# EAGLE design howland_vccs_single_ended (EAGLE 6.4)
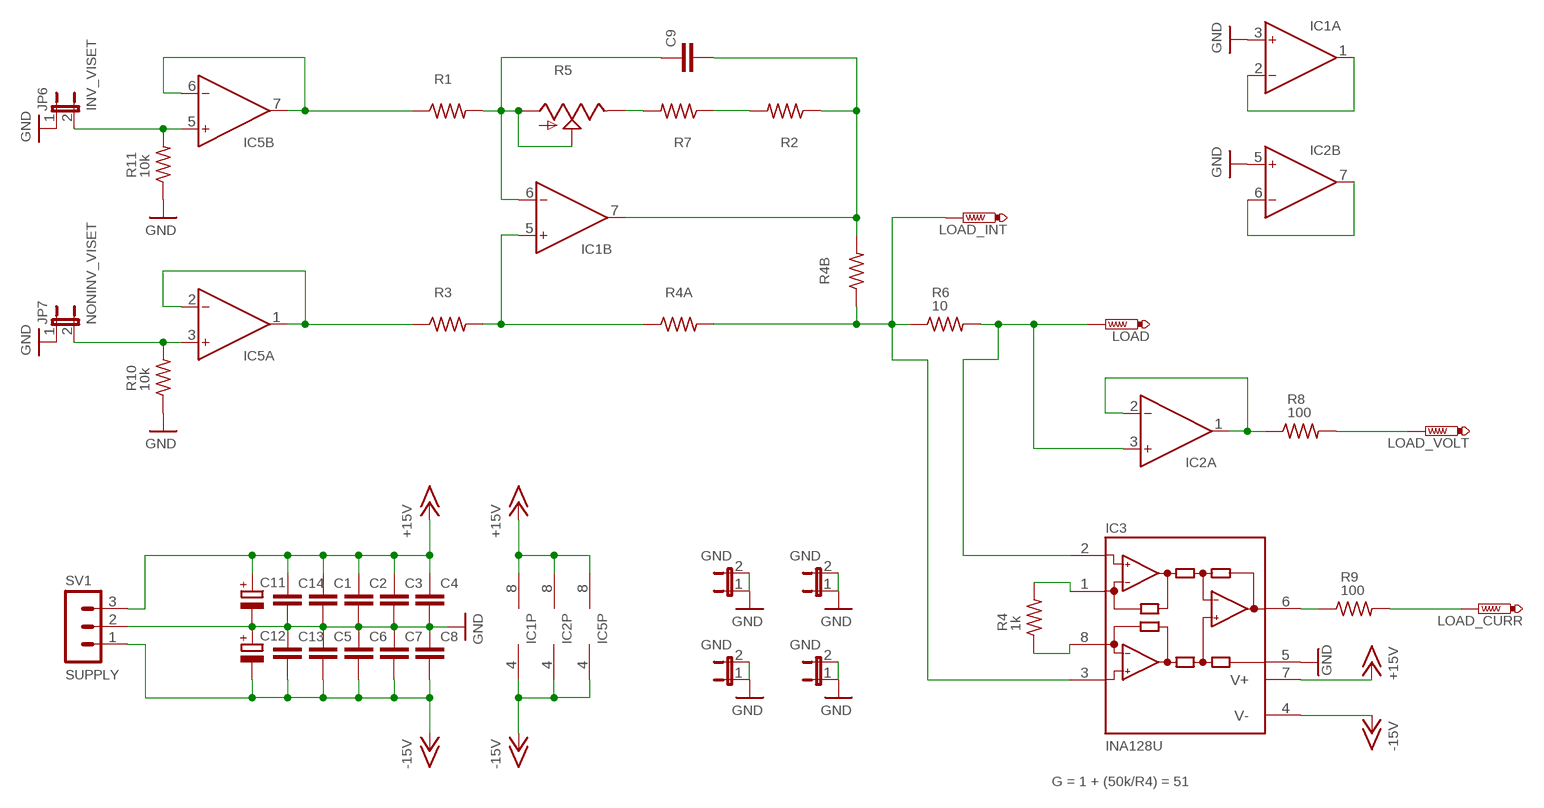
[diagram p0: schematic, sheet 1]

## Parts
C1  C-EUC1206  [C1206]
C2  C-EUC1206  [C1206]
C3  C-EUC1206  [C1206]
C4  C-EUC1206  [C1206]
C5  C-EUC1206  [C1206]
C6  C-EUC1206  [C1206]
C7  C-EUC1206  [C1206]
C8  C-EUC1206  [C1206]
C9  C-EUC1206  [C1206]
C11  CPOL-EUC/6032-28R  [C/6032-28R]
C12  CPOL-EUC/6032-28R  [C/6032-28R]
C13  C-EUC1206  [C1206]
C14  C-EUC1206  [C1206]
IC1  LM358  AD826R  [SO8]
IC2  LM358  AD826R  [SO8]
IC3  INA128U  [SO08]
IC5  OPA2192  AD826R  [SO8]
JP4  GND  JP1E  [JP1]
JP6  INV_VISET  JP1E  [JP1]
JP7  NONINV_VISET  JP1E  [JP1]
JP8  GND  JP1E  [JP1]
JP9  GND  JP1E  [JP1]
JP10  GND  JP1E  [JP1]
LOAD  PTR1PAD1-13  [P1-13]
LOAD_CURR  PTR1PAD1-13  [P1-13]
LOAD_INT  PTR1PAD1-13  [P1-13]
LOAD_VOLT  PTR1PAD1-13  [P1-13]
R1  12.25k/0.1%  R-US_R1206  [R1206]
R2  10k/.1%  R-US_R1206  [R1206]
R3  12.25k/0.1%  R-US_R1206  [R1206]
R4  1k  R-US_R1206  [R1206]
R4A  10k/.1%  R-US_R1206  [R1206]
R4B  250  R-US_R1206  [R1206]
R5  100  TRIM_US-3223J  [3223J]
R6  10  R-US_R1206  [R1206]
R7  200  R-US_R1206  [R1206]
R8  100  R-US_R1206  [R1206]
R9  100  R-US_R1206  [R1206]
R10  10k  R-US_R1206  [R1206]
R11  10k  R-US_R1206  [R1206]
SV1  SUPPLY  MA03-1  [MA03-1]

## Nets
+15V: C1.1 C2.1 C3.1 C4.1 C11.+ C14.1 IC1.8(P:V+) IC2.8(P:V+) IC3.7(V+) IC5.8(P:V+) SV1.3
-15V: C5.2 C6.2 C7.2 C8.2 C12.- C13.2 IC1.4(P:V-) IC2.4(P:V-) IC3.4(V-) IC5.4(P:V-) SV1.1
GND: C1.2 C2.2 C3.2 C4.2 C5.1 C6.1 C7.1 C8.1 C11.- C12.+ C13.1 C14.2 IC1.3(A:IN+) IC2.5(B:IN+) IC3.5(REF) JP4.1 JP4.2 JP6.1 JP7.1 JP8.1 JP8.2 JP9.1 JP9.2 JP10.1 JP10.2 R10.1 R11.1 SV1.2
N$1: IC2.1(A:OUT) IC2.2(A:IN-) R8.1
N$2: IC1.5(B:IN+) R3.2 R4A.1
N$3: C9.1 IC1.6(B:IN-) R1.2 R5.1(A) R5.2(S)
N$4: C9.2 IC1.7(B:OUT) R2.1 R4B.2
N$5: IC3.3(+IN) LOAD_INT.TP R4A.2 R4B.1 R6.1
N$6: R5.3(E) R7.2
N$7: IC3.1(RG) R4.2
N$8: IC3.8(RG) R4.1
N$9: IC3.6(OUT) R9.1
N$10: IC1.1(A:OUT) IC1.2(A:IN-)
N$11: R2.2 R7.1
N$12: IC5.1(A:OUT) IC5.2(A:IN-) R3.1
N$13: IC5.6(B:IN-) IC5.7(B:OUT) R1.1
N$14: IC5.3(A:IN+) JP7.2 R10.2
N$15: IC5.5(B:IN+) JP6.2 R11.2
N$16: LOAD_VOLT.TP R8.2
N$17: LOAD_CURR.TP R9.2
N$25: IC2.6(B:IN-) IC2.7(B:OUT)
N$26: IC2.3(A:IN+) IC3.2(-IN) LOAD.TP R6.2

## Notes on the sheet
- G = 1 + (50k/R4) = 51

## Library data of the parts
C1-C9 C13 C14 = rcl:C-EU: CAPACITOR, European symbol
C11 C12 = rcl:CPOL-EU: POLARIZED CAPACITOR, European symbol
IC1 IC2 IC5 = analog-devices:AD826: High-Speed, Low-Power Dual Operational Amplifier Source: http://www.analog.com/static/imported-files/data_sheets/AD826.pdf; MF: ALTERA CORPORATION; MPN: AD826AR; OC_FARNELL: 1651291; OC_NEWARK: 05F7688
IC3 = burr-brown:INA128: Instrumentation Amplifiers Precision, Low Power; MF: TEXAS INSTRUMENTS; MPN: INA128U; OC_FARNELL: 1212413; OC_NEWARK: 35C1729
JP4 JP6-JP10 = jumper:JP1E: JUMPER
LOAD LOAD_CURR LOAD_INT LOAD_VOLT = testpad:PTR1: TEST PIN
R1-R4 R4A R4B R6-R11 = rcl:R-US_: RESISTOR, American symbol
R5 = pot:TRIM_US-: POTENTIOMETER
SV1 = con-lstb:MA03-1: PIN HEADER; OC_FARNELL: unknown; OC_NEWARK: unknown

## Board
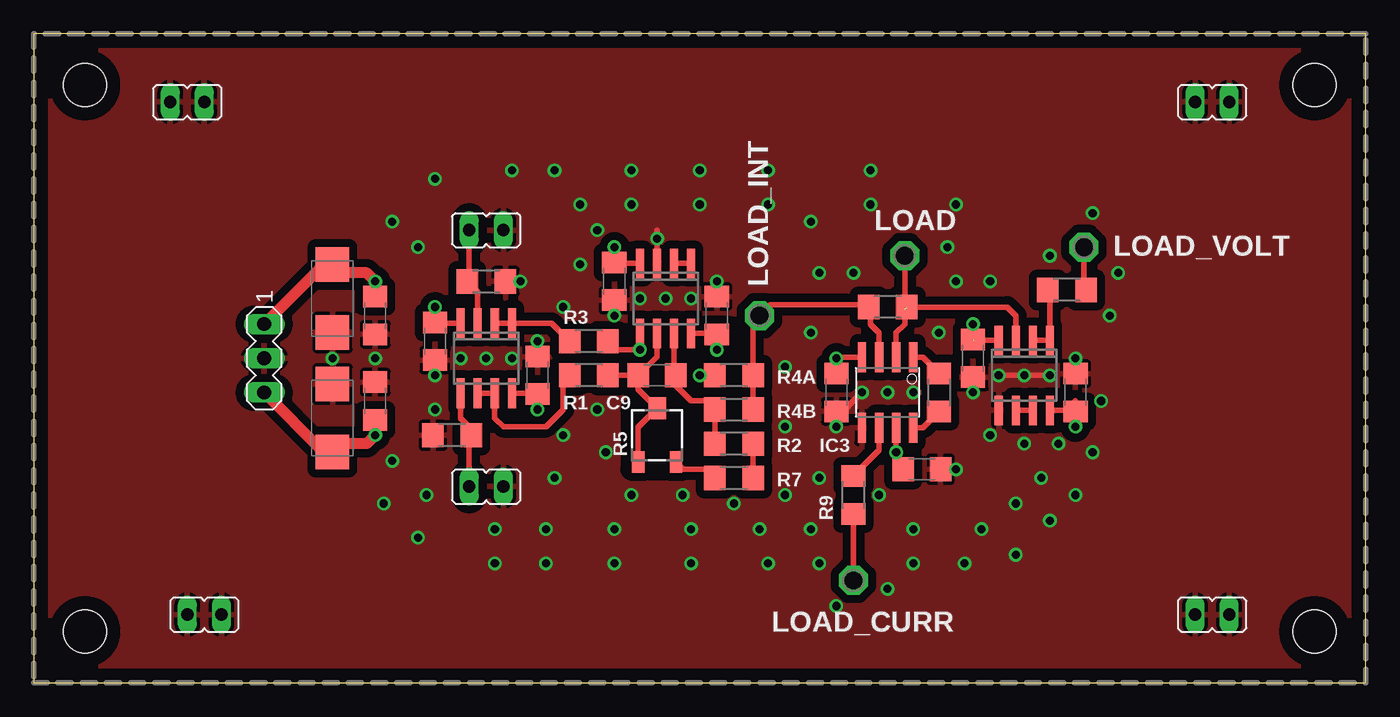
[diagram p1: board, top side]
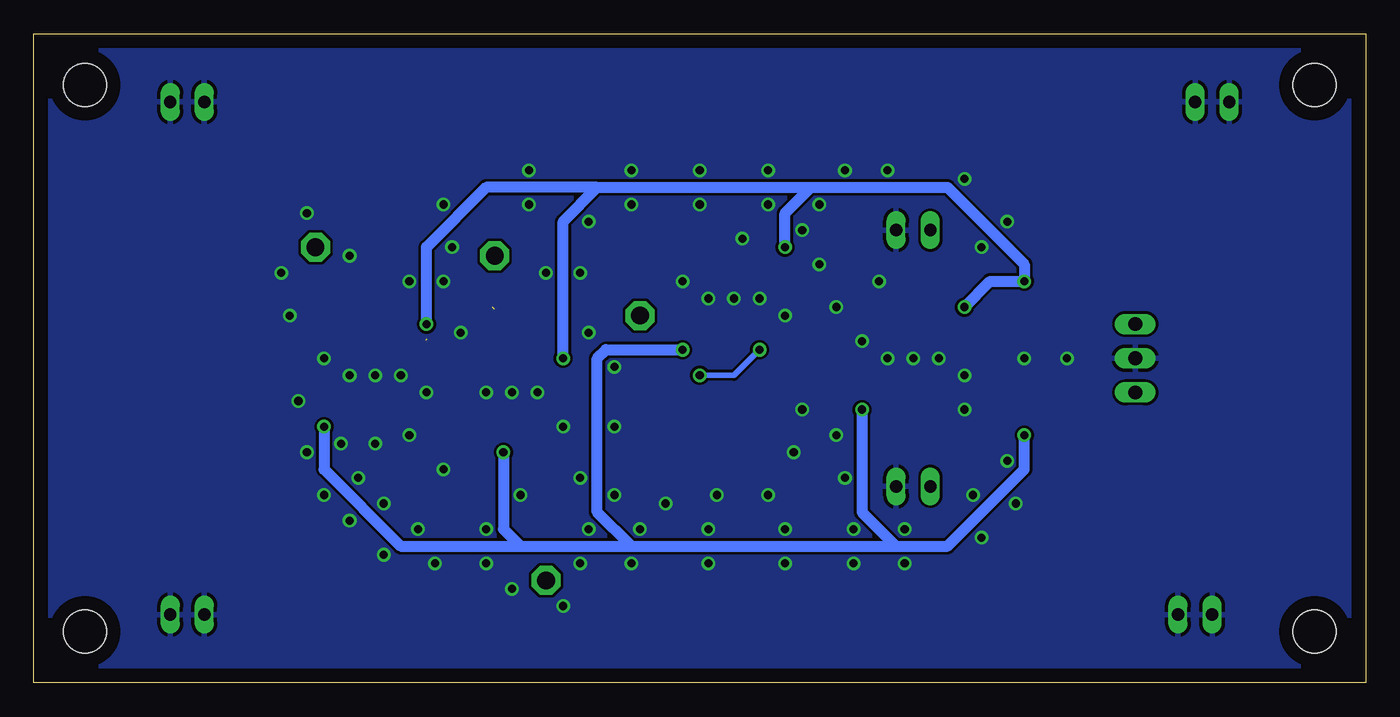
[diagram p2: board, bottom side, seen from below]

Size 99.06 x 48.26 mm. Coordinates in mm from the lower left corner, seen from the top.
Outline: 0,0 99.06,0 99.06,48.26 0,48.26 0,0
Copper layers (1*16): Top 0.035mm / dielectric 1.5mm / Bottom 0.035mm
Design rules "default *": minimum track width 10mil, minimum drill 24mil, track to track 8mil, track to pad 8mil, pad to pad 8mil, via to via 8mil, smd to smd 8mil, copper to edge 40mil, drill to drill 8mil, minimum pad ring 10mil, minimum via ring 8mil, stop-mask expansion 4mil, vias tented up to drill 0mil, thermal gap 10mil
Holes 3.2 mm at 3.81,44.45 95.25,44.45 3.81,3.81 95.25,3.81
tRestrict: 4 lines

### Footprints (pad centres in the part's own frame; a part is rotated, then mirrored left to right if it is on the bottom)
C1206 = smd 1.6 x 1.8: 1 -1.4,0; 2 1.4,0
C/6032-28R = smd 2.55 x 2.5: + 2.525,0; - -2.525,0
SO8 = smd 0.6 x 2.2: 1 -1.905,-2.6; 2 -0.635,-2.6; 3 0.635,-2.6; 4 1.905,-2.6; 5 1.905,2.6; 6 0.635,2.6; 7 -0.635,2.6; 8 -1.905,2.6
SO08 = smd 0.61 x 2.21: 1 -1.905,-2.616; 2 -0.635,-2.616; 3 0.635,-2.616; 4 1.905,-2.616; 5 1.905,2.616; 6 0.635,2.616; 7 -0.635,2.616; 8 -1.905,2.616
JP1 = drill 0.914 long: 1 0,-1.27; 2 0,1.27
P1-13 = drill 1.321 pad 2.159 octagon: TP 0,0
R1206 = smd 1.6 x 1.803: 1 -1.422,0; 2 1.422,0
3223J = smd 1.6 x 0.9: 1 -2,1.4; 3 -2,-1.4 | smd 1.6 x 1.3: 2 2,0
MA03-1 = drill 1.016 long: 1 -2.54,0; 2 0,0; 3 2.54,0

### Placement (x,y rotation side)
C1  50.8,27.3 90 top
C2  77.47,21.59 90 top
C3  66.04,15.87 0 top
C4  37.47,22.86 90 top
C5  43.18,29.84 90 top
C6  69.85,24.13 90 top
C7  59.69,21.59 90 top
C8  29.85,25.4 90 top
C9  46.36,22.86 0 top
C11  22.23,19.68 270 top
C12  22.23,28.57 270 top
C13  25.4,27.3 90 top
C14  25.4,20.95 90 top
IC1  46.99,28.57 180 top
IC2  73.66,22.86 180 top
IC3  63.5,21.59 180 top
IC5  33.66,24.13 180 top
JP4  11.43,43.18 90 top
JP6  33.66,14.6 90 top
JP7  33.66,33.66 90 top
JP8  87.63,43.18 90 top
JP9  12.7,5.08 90 top
JP10  87.63,5.08 90 top
LOAD  64.77,31.75 0 top
LOAD_CURR  60.96,7.62 0 top
LOAD_INT  53.98,27.3 0 top
LOAD_VOLT  78.11,32.38 0 top
R1  41.27,22.86 0 top
R2  52.07,17.78 0 top
R3  41.27,25.4 0 top
R4  67.31,21.59 90 top
R4A  52.07,22.86 0 top
R4B  52.07,20.32 180 top
R5  46.36,18.41 90 top
R6  63.5,27.94 0 top
R7  52.07,15.24 180 top
R8  76.84,29.21 0 top
R9  60.96,13.97 270 top
R10  33.66,29.84 180 top
R11  31.12,18.41 0 top
SV1  17.15,24.13 270 top

### Tracks (layer width: path | path; a pad name or v marks a point on that pad's centre or on a via)
+15V  (via drill 0.6, 0.6 pad 0.25)
  Top 0.406: IC3.7 v64.14,17.14 64.14,16.38 C3.1 64.64,16 | IC2.8 76.78,20.26 77.47,20.95 C2.1 v77.47,19.05 | v50.8,24.77 C1.1 50.73,25.97 IC1.8 | v37.47,20.32 C4.1 37.4,21.53 IC5.8
  Top 0.813: C14.1 v25.4,18.41 24.77,17.78 22.85,17.78 C11.+ 21.58,17.16 SV1.3
  Bottom 0.813: v64.14,17.14 64.14,11.43 62.87,10.16 | 54.61,10.16 57.15,12.7 57.15,24.13 56.52,24.77 v50.8,24.77 | v77.47,19.05 77.47,15.87 71.75,10.16 62.87,10.16 | 62.87,10.16 54.61,10.16 | 54.61,10.16 34.92,10.16 | 34.92,10.16 31.12,10.16 25.4,15.87 v25.4,18.41 | v37.47,20.32 37.47,12.7 34.92,10.16
-15V  (via drill 0.6, 0.6 pad 0.25)  (1 unrouted)
  Top 0.406: IC3.4 59.77,24.21 v59.69,24.13 C7.2 | v29.85,27.94 C8.2 29.92,26.73 IC5.4 | C6.2 v69.85,26.67 | IC2.4 69.91,25.46 | IC1.4 43.25,31.17 C5.2 v43.18,32.38
  Top 0.813: C13.2 v25.4,29.84 24.77,30.48 22.85,30.48 C12.- 21.58,31.1 SV1.1
  Bottom 0.813: v43.18,32.38 43.18,34.92 41.27,36.83 | v69.85,26.67 69.85,32.38 65.41,36.83 57.15,36.83 | v59.69,24.13 59.69,34.29 57.15,36.83 | 57.15,36.83 41.27,36.83 | 41.27,36.83 31.12,36.83 25.4,31.11 v25.4,29.84 27.94,29.84 v29.85,27.94
GND  (via drill 0.6 pad 0.25)
  Top 0.406: C2.2 v77.47,24.13 | C7.1 59.69,19.68 | v71.75,22.86 v75.56,22.86 | v61.59,21.59 59.69,19.68 | 59.69,19.68 v59.69,19.05 | IC1.3 46.36,33.66
  other vias: 57.79,26.04 41.91,33.66 44.45,35.56 42.55,17.14 44.45,13.97 48.26,13.97 78.74,17.14 46.36,33.02 58.42,30.48 29.85,22.86 37.47,25.4 68.58,15.87 60.96,30.48 57.79,34.29 55.88,13.97 58.42,15.24 41.91,20.32 69.85,21.59 25.4,24.13 22.23,24.13 29.85,20.32 28.58,32.38 36.2,29.84 39.37,27.94 43.18,27.3 39.37,18.41 33.66,24.13 31.75,24.13 35.56,24.13 55.88,23.49 40.64,31.11 63.5,21.59 65.41,21.59 73.66,22.86 71.12,18.41 73.66,17.78 76.2,17.78 79.38,20.95 80.64,30.48 80.01,27.3 75.56,31.75 68.58,29.84 67.31,26.04 71.12,29.84 38.1,11.43 43.18,8.89 38.73,38.1 29.85,37.47 48.9,8.89 55.88,19.05 54.61,8.89 77.47,13.97 57.79,11.43 58.42,8.89 65.41,11.43 35.56,38.1 49.53,38.1 49.53,35.56 54.61,38.1 62.23,35.56 68.58,35.56 62.23,38.1 67.94,32.38 78.74,34.92 26.67,34.29 40.64,35.56 50.8,29.84 44.45,38.1 54.61,35.56 43.18,11.43 34.29,11.43 38.1,8.89 34.29,8.89 29.21,13.97 26.67,16.51 74.93,15.24 73.03,13.33 75.56,12.06 73.03,9.52 70.48,11.43 65.41,8.89 69.22,8.89 63.5,6.98 59.69,5.71 28.58,10.79 26.04,13.33 46.99,28.57 48.9,28.57 45.09,28.57 62.87,13.97 38.73,15.24 53.98,11.43 48.9,11.43 52.07,13.33
  pour Bottom: 1.27,46.99 97.79,46.99 97.79,1.27 1.27,1.27
  pour Top (isolate 0.61): 1.27,46.99 97.79,46.99 97.79,1.27 1.27,1.27
N$1
  Top 0.406: IC2.2 IC2.1 75.56,29.06 R8.1
N$2  (via drill 0.6)
  Top 0.406: IC1.5 v45.09,24.77 43.33,24.77 R3.2 | v49.53,22.86 R4A.1
  Bottom 0.406: v45.09,24.77 46.99,22.86 v49.53,22.86
N$3
  Top 0.406: IC1.6 46.36,24.26 C9.1 | C9.1 R1.2 | R5.1 44.95,19.02 R5.2 44.95,21.81 C9.1
N$4
  Top 0.406: IC1.7 47.62,22.99 C9.2 47.76,22.09 48.9,20.95 50.8,20.95 50.8,20.47 R4B.2 R2.1
N$5
  Top 0.406: IC3.3 62.87,26.04 62.23,26.67 62.23,27.79 R6.1 61.93,28.09 54.76,28.09 LOAD_INT.TP 53.49,26.52 R4A.2 R4B.1
N$6
  Top 0.406: R7.2 50.65,15.39 50.16,15.87 48.3,15.87 R5.3
N$7
  Top 0.406: IC3.1 66.12,24.21 R4.2
N$8
  Top 0.406: IC3.8 66.12,18.97 R4.1
N$9
  Top 0.406: IC3.6 62.87,17.3 R9.1
N$10
  Top 0.406: IC1.2 IC1.1
N$11
  Top 0.406: R7.1 R2.2
N$12
  Top 0.406: IC5.2 IC5.1 38.52,26.73 R3.1
N$13
  Top 0.406: IC5.6 IC5.7 34.29,19.68 34.92,19.05 38.1,19.05 39.37,20.32 39.37,22.38 R1.1
N$14
  Top 0.406: IC5.3 33.02,29.06 R10.2 32.39,30 JP7.2
N$15
  Top 0.406: IC5.5 31.75,19.68 32.39,19.05 32.39,18.57 R11.2 32.39,18.26 JP6.2
N$16
  Top 0.406: LOAD_VOLT.TP 78.11,29.36 R8.2
N$17
  Top 0.406: R9.2 LOAD_CURR.TP
N$25
  Top 0.406: IC2.6 IC2.7
N$26  (1 unrouted)
  Top 0.406: IC3.2 64.14,26.04 64.77,26.67 64.77,27.79 | IC2.3 73.03,27.3 72.39,27.94 R6.2 64.77,28.09 LOAD.TP

### Text on the board
tDocu: Single-ended "improved" Howland VCCS | -15V | GND | +15V